# EAGLE schematic BQ24650_Charger (EAGLE 9.5.2)
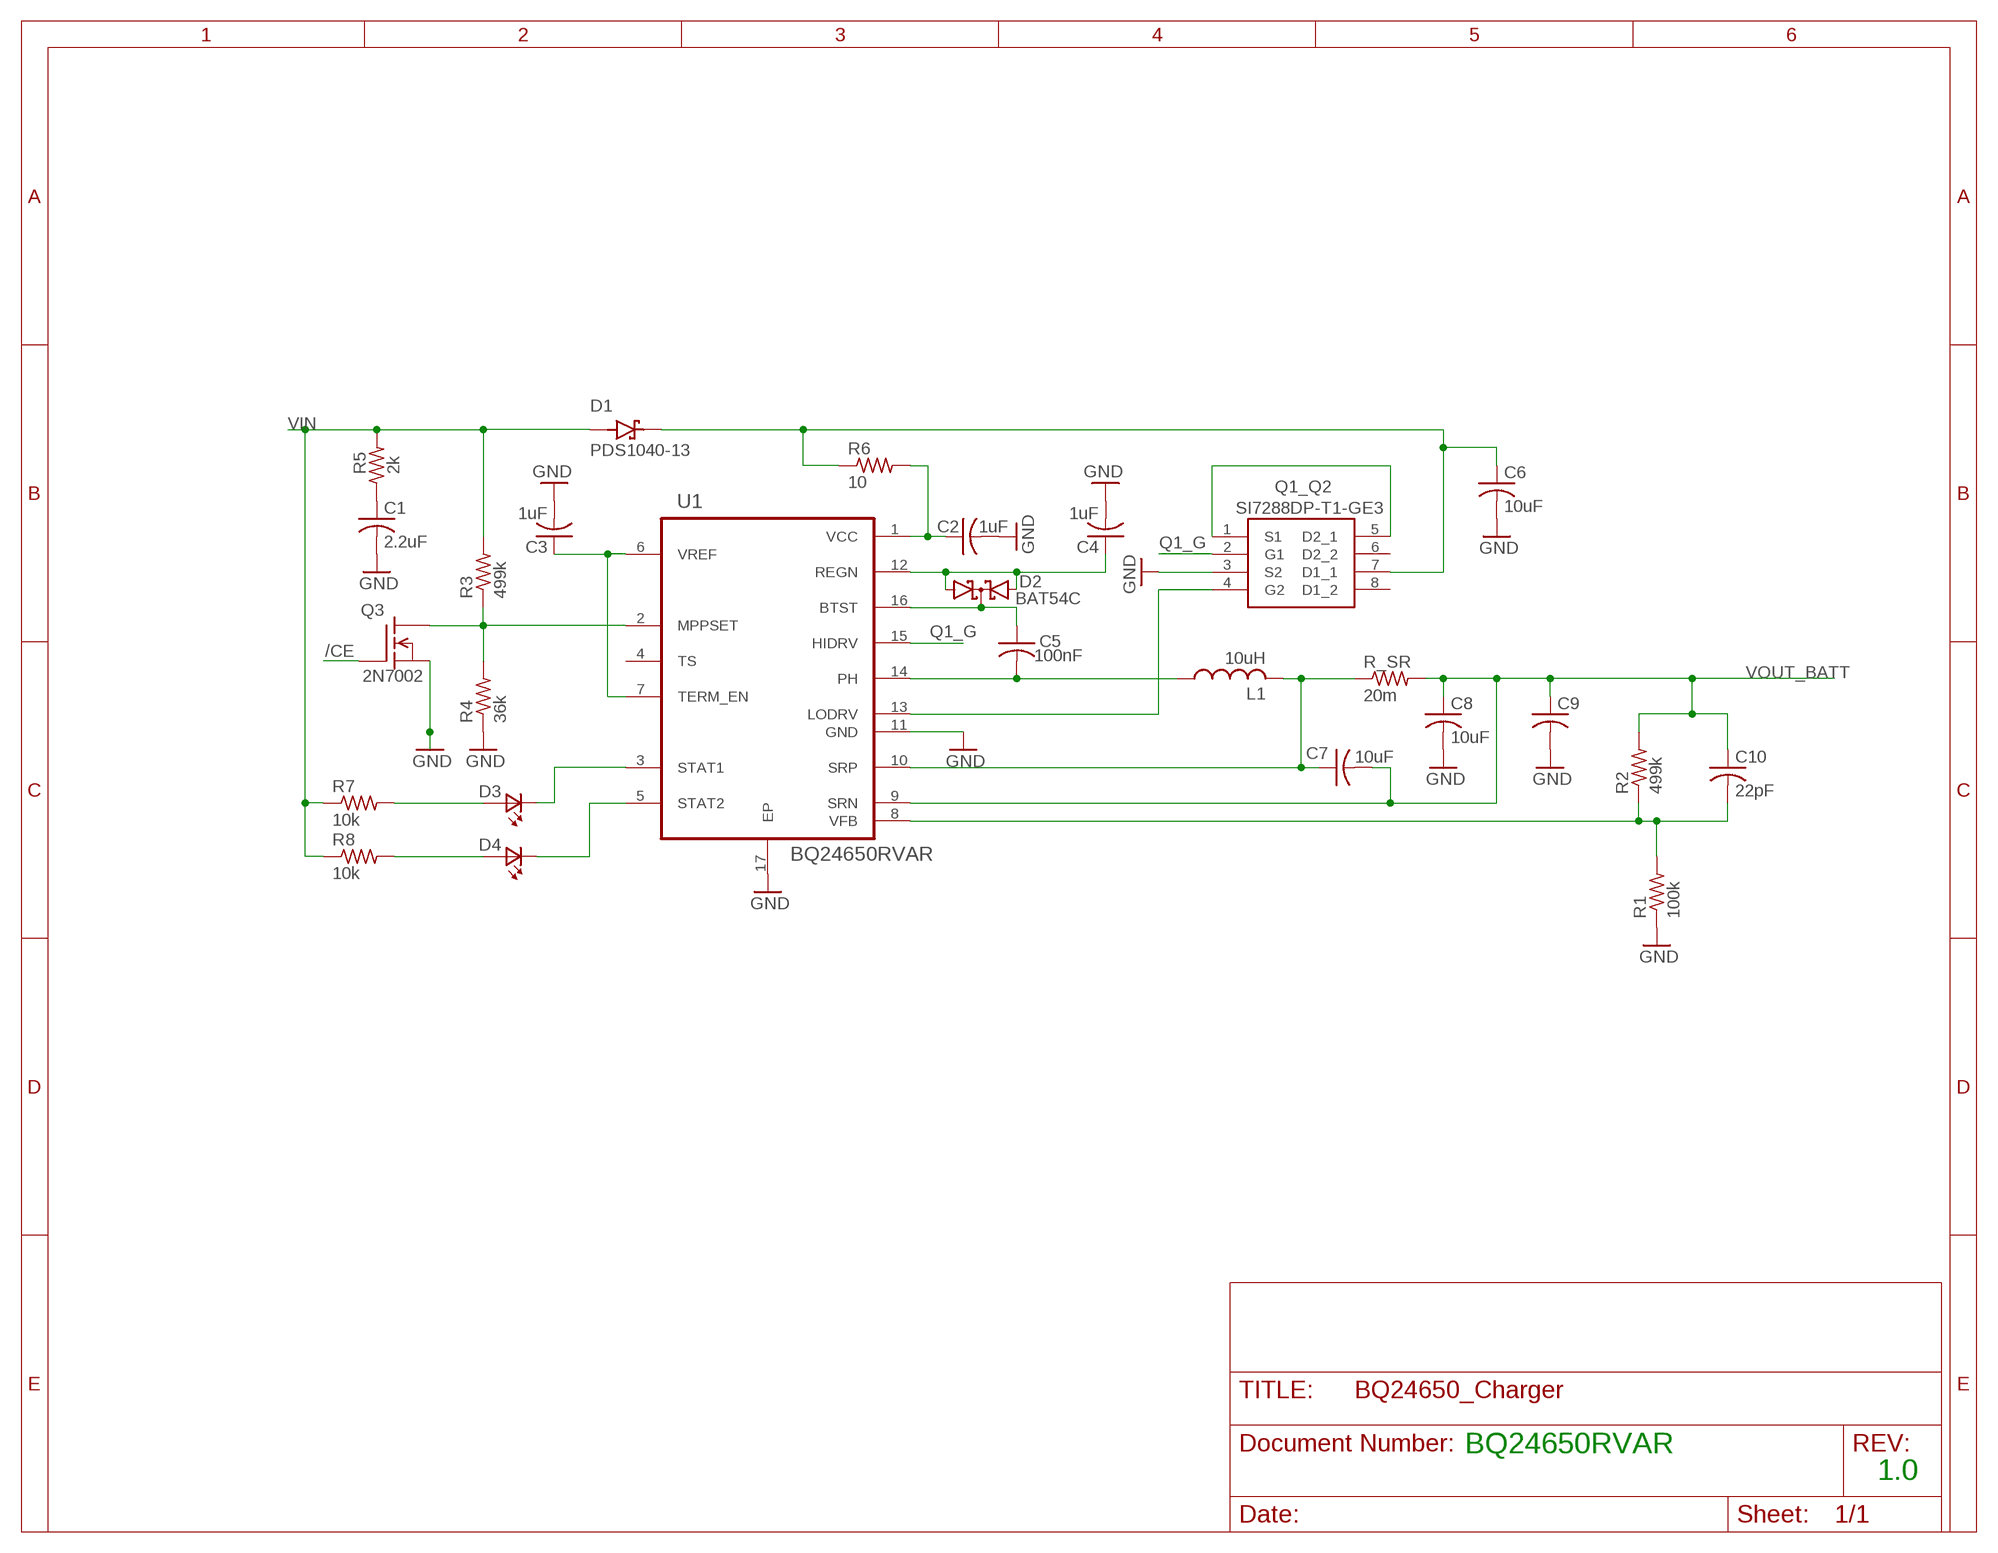
[diagram p0: schematic, sheet 1]

## Parts
C1  2.2uF  C-USC0805  [C0805]
C2  1uF  C-USC0805  [C0805]
C3  1uF  C-USC0805  [C0805]
C4  1uF  C-USC0805  [C0805]
C5  100nF  C-USC0805  [C0805]
C6  10uF  C-USC0805  [C0805]
C7  10uF  C-USC0805  [C0805]
C8  10uF  C-USC0805  [C0805]
C9  C-USC0805  [C0805]
C10  22pF  C-USC0805  [C0805]
D1  PDS1040-13  [DIO_PDS1040-13]
D2  BAT54C  [SOT23]
D3  LTST-C190GKT  [0603]
D4  LTST-C190GKT  [0603]
L1  10uH  L-USL3225M  [L3225M]
Q1_Q2  SI7288DP-T1-GE3  [POWERPAK-SO8_1]
Q3  2N7002  [SOT23]
R1  100k  R-US_R0805  [R0805]
R2  499k  R-US_R0805  [R0805]
R3  499k  R-US_R0805  [R0805]
R4  36k  R-US_R0805  [R0805]
R5  2k  R-US_R0805  [R0805]
R6  10  R-US_R0805  [R0805]
R7  10k  R-US_R0805  [R0805]
R8  10k  R-US_R0805  [R0805]
R_SR  20m  R-US_R0805  [R0805]
U1  BQ24650RVAR  [QFN50P350X350X100-17N]

## Nets
/CE: Q3.1(G)
GND: C1.2 C2.2 C3.2 C4.2 C6.2 C8.2 C9.2 Q1_Q2.3(S2) R1.1 R4.1 U1.11(GND) U1.17(EP)
N$1: Q3.3(D) R3.1 R4.2 U1.2(MPPSET)
N$2: C3.1 U1.6(VREF) U1.7(TERM_EN)
N$3: C1.1 R5.1
N$4: C2.1 R6.2 U1.1(VCC)
N$5: C4.1 D2.1(A1) D2.2(A2) U1.12(REGN)
N$6: C5.2 L1.1 U1.14(PH)
N$7: C5.1 D2.3(CC) U1.16(BTST)
N$8: Q3.2(S)
N$9: C10.2 R1.2 R2.1 U1.8(VFB)
N$10: D4.2(A2) R8.2
N$11: C7.1 L1.2 R_SR.1 U1.10(SRP)
N$12: D3.2(A2) R7.2
N$13: D3.1(K2) U1.3(STAT1)
N$14: D4.1(K2) U1.5(STAT2)
N$15: Q1_Q2.1(S1) Q1_Q2.5(D2_1)
N$16: Q1_Q2.4(G2) U1.13(LODRV)
Q1_G: Q1_Q2.2(G1) U1.15(HIDRV)
SC_VIN: C6.1 D1.3(K) Q1_Q2.7(D1_1) R6.1
VIN: D1.1(A) D1.2(A) R3.2 R5.2 R7.1 R8.1
VOUT_BATT: C7.2 C8.1 C9.1 C10.1 R2.2 R_SR.2 U1.9(SRN)
Unconnected: Q1_Q2.6(D2_2) Q1_Q2.8(D1_2) U1.4(TS)

## Notes on the sheet
- BQ24650RVAR
- 1.0

## Library data of the parts
C1-C10 = rcl:C-US: CAPACITOR, American symbol; SPICEPREFIX: C
D1 = PDS1040-13:PDS1040-13: PDS1040 Series 40 V 10 A Surface Mount Schottky Barrier Rectifier - PowerDI 5; AVAILABILITY: Unavailable; DESCRIPTION: Diode Schottky 40V 10A Surface Mount PowerDI™ 5; MF: Diodes Inc.; MP: PDS1040-13; PACKAGE: PowerDI™-5 Diodes Inc.; PRICE: None
D2 = diode:BAT54C: Schottky Diodes Source: Fairchild .. BAT54.pdf
D3 D4 = LTST-C190GKT:LTST-C190GKT: https://octopart.com/ltst-c190gkt-lite-on-549821; AVAILABILITY: Unavailable; DESCRIPTION: Green 569nm LED Indication - Discrete 2.1V 0603 _1608 Metric_; MF: Lite-On Inc.; MP: LTST-C190GKT; PACKAGE: 0603 Lite-On; PRICE: None
L1 = rcl:L-US: INDUCTOR, American symbol; SPICEPREFIX: L
Q1_Q2 = SI7288DP-T1-GE3:SI7288DP-T1-GE3: Trans MOSFET N-CH 40V 10An Vishay SI7288DP-T1-GE3 Dual N-channel MOSFET Transistor, 20 A, 40 V, 8-Pin PowerPAK SO Source: Datasheet <https://www.vishay.com/docs/65366/si7288dp.pdf>; ALLIED_NUMBER: 70459563; ALLIED_PRICE-STOCK: https://www.alliedelec.com/siliconix-vishay-si7288dp-t1-ge3/70459563/; DESCRIPTION: Trans MOSFET N-CH 40V 10An Vishay SI7288DP-T1-GE3 Dual N-channel MOSFET Transistor, 20 A, 40 V, 8-Pin PowerPAK SO; HEIGHT: mm; MANUFACTURER_NAME: Vishay; MANUFACTURER_PART_NUMBER: SI7288DP-T1-GE3; MOUSER_PART_NUMBER: 781-SI7288DP-T1-GE3; MOUSER_PRICE-STOCK: https://www.mouser.com/Search/Refine.aspx?Keyword=781-SI7288DP-T1-GE3; RS_PART_NUMBER: 8181390P; RS_PRICE-STOCK: http://uk.rs-online.com/web/p/products/8181390P
Q3 = 2N7002:2N7002; AVAILABILITY: Unavailable; DESCRIPTION: N-Channel 60V 200mA _Tc_ 350mW _Tc_ Surface Mount SOT-23-3; MF: STMicroelectronics; MP: 2N7002; PACKAGE: SOT-23-3 Vishay; PRICE: None
R1-R8 R_SR = rcl:R-US_: RESISTOR, American symbol; SPICEPREFIX: R
U1 = TexasInstruments:BQ24650RVAR: Synchronous Switch-Mode Battery Charge Controller; AVAILABILITY: Unavailable; DESCRIPTION: Charger IC Multi-Chemistry 16-VQFN _3.5x3.5_; MF: Texas Instruments; MP: BQ24650RVAR; PACKAGE: VFQFN-16 Murata Power Solutions; PRICE: None